# EAGLE design ThermoActuator (EAGLE 7.1.0)
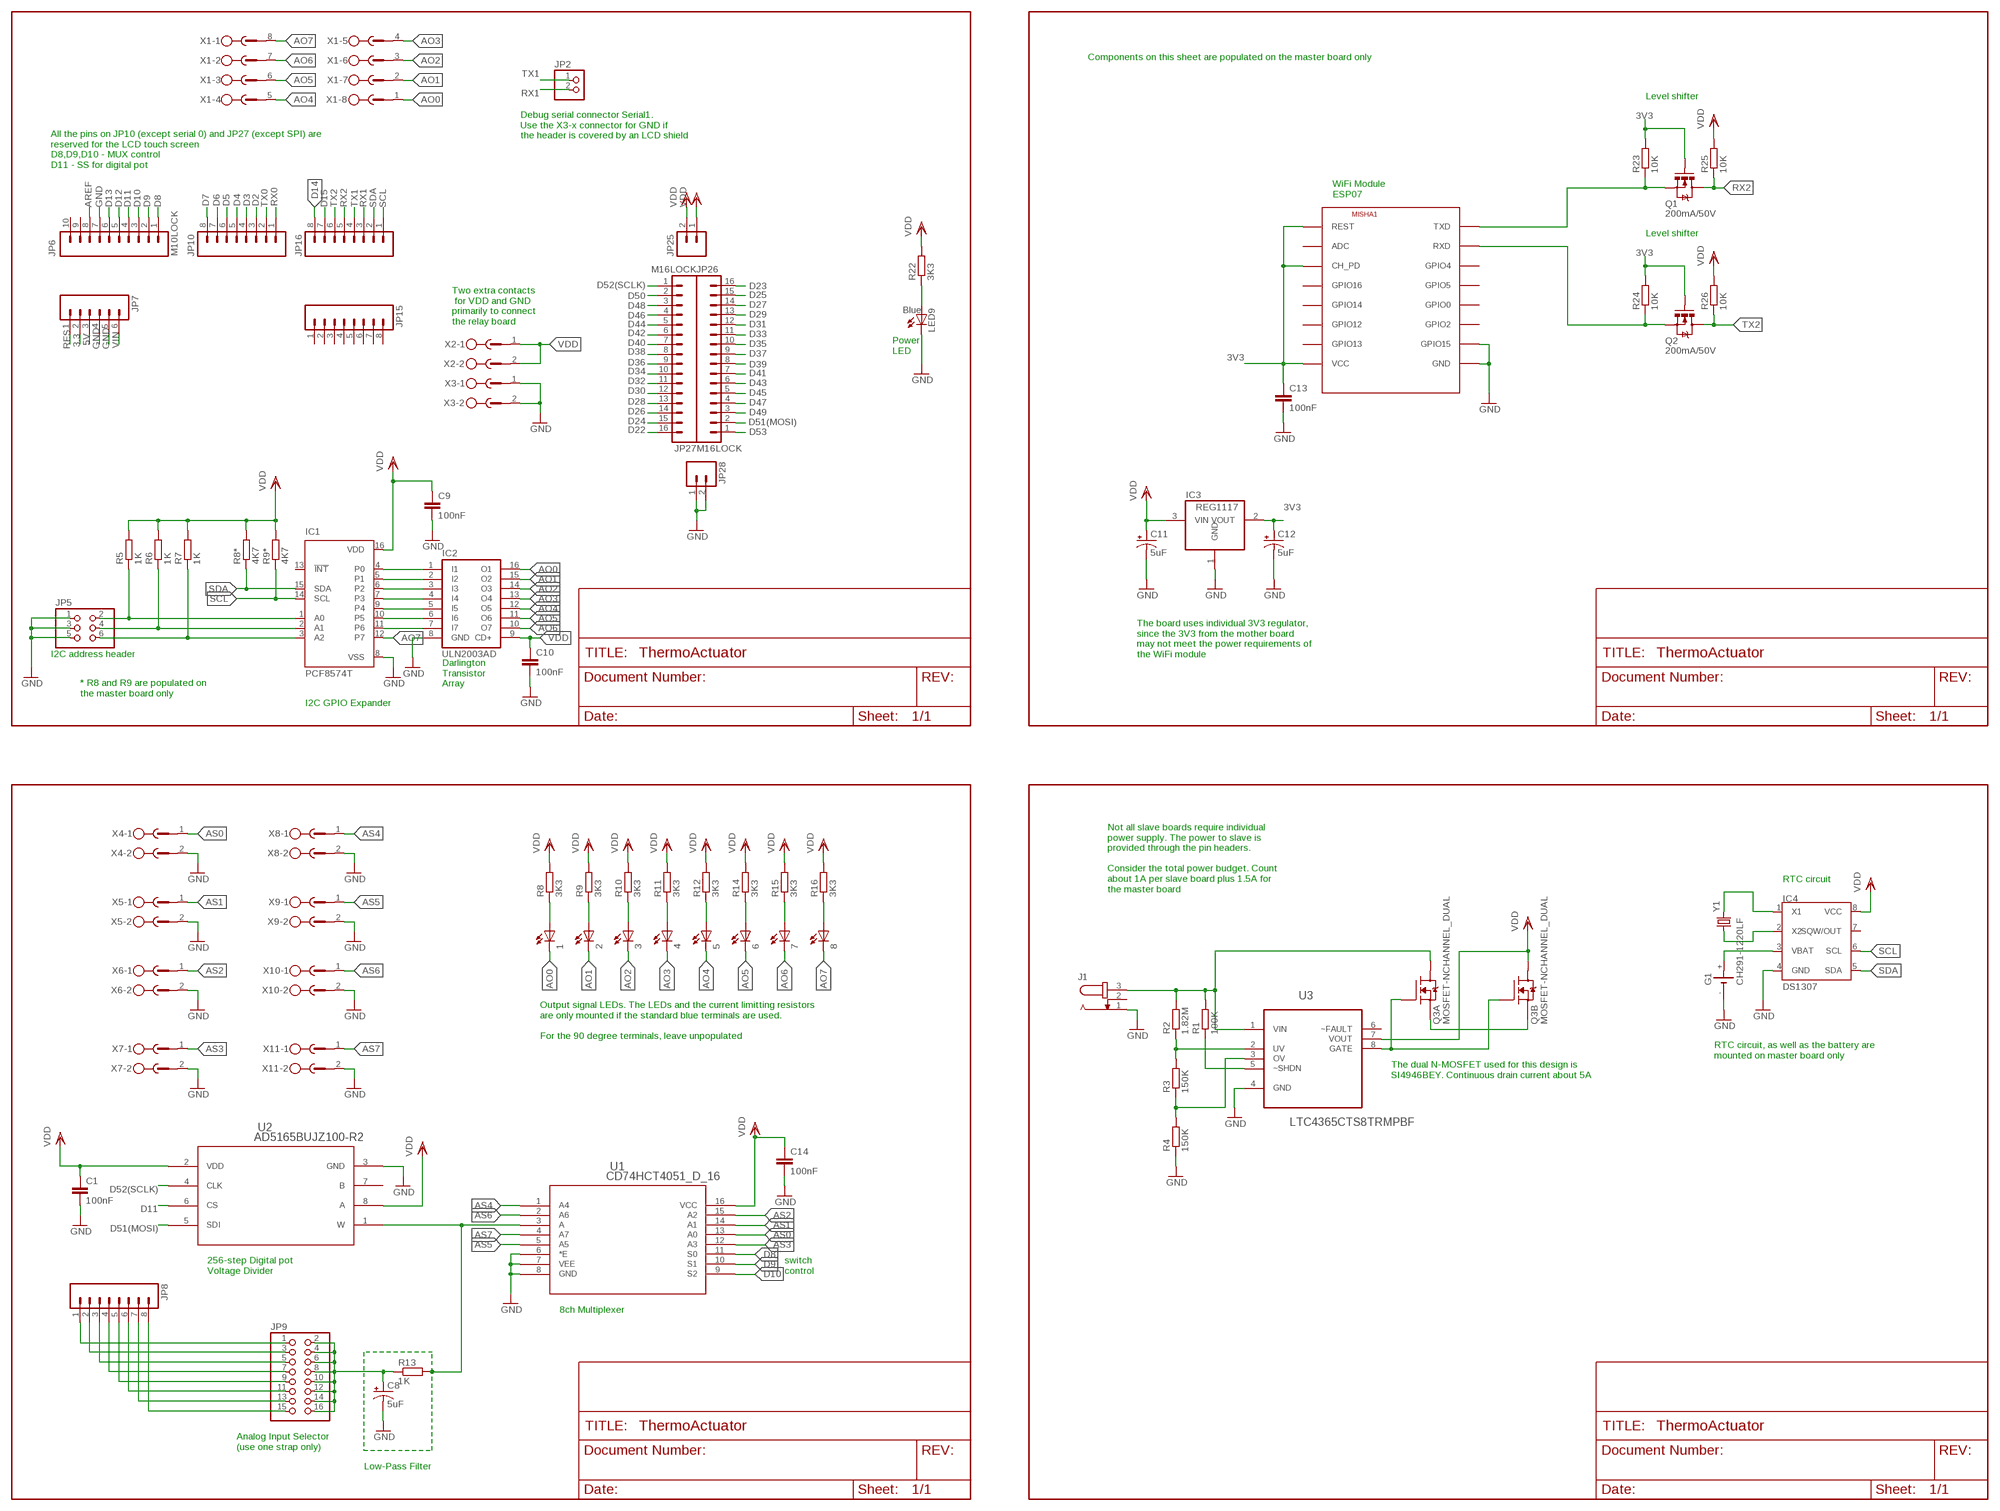
[diagram p0: schematic, sheet 1]

## Parts
1  LEDCHIP-LED0805  [CHIP-LED0805]
2  LEDCHIP-LED0805  [CHIP-LED0805]
3  LEDCHIP-LED0805  [CHIP-LED0805]
4  LEDCHIP-LED0805  [CHIP-LED0805]
5  LEDCHIP-LED0805  [CHIP-LED0805]
6  LEDCHIP-LED0805  [CHIP-LED0805]
7  LEDCHIP-LED0805  [CHIP-LED0805]
8  LEDCHIP-LED0805  [CHIP-LED0805]
C1  100nF  C-EUC0805  [C0805]
C8  5uF  CAP_POL1206  [EIA3216]
C9  100nF  C-EUC0805  [C0805]
C10  100nF  C-EUC0805  [C0805]
C11  5uF  CAP_POL1206  [EIA3216]
C12  5uF  CAP_POL1206  [EIA3216]
C13  100nF  C-EUC0805  [C0805]
C14  100nF  C-EUC0805  [C0805]
G1  CH291-1220LF  [CH291-1220LF]
IC1  PCF8574T  [SO16W]
IC2  ULN2003AD  [SO16]
IC3  REG1117  [SOT223]
IC4  DS1307  [SOIC-8]
J1  JACK-PLUG1  [SPC4078]
JP2  PINHD-1X2  [1X02]
JP5  PINHD-2X3  [2X03]
JP6  M10LOCK  [1X10_LOCK]
JP7  M06LOCK  [1X06_LOCK]
JP8  M08LOCK  [1X08_LOCK]
JP9  PINHD-2X8  [2X08]
JP10  M08LOCK  [1X08_LOCK]
JP15  M08LOCK  [1X08_LOCK]
JP16  M08LOCK  [1X08_LOCK]
JP25  M02LOCK  [1X02_LOCK]
JP26  M16LOCK  [1X16_LOCK]
JP27  M16LOCK  [1X16_LOCK]
JP28  M02LOCK  [1X02_LOCK]
LED9  Blue  LEDCHIP-LED0805  [CHIP-LED0805]
MISHA1  ESP8266-07  [ESP-07]
Q1  200mA/50V  MOSFET-NCHANNELBSS138  [SOT23-3]
Q2  200mA/50V  MOSFET-NCHANNELBSS138  [SOT23-3]
Q3  MOSFET-NCHANNEL_DUAL  [SO08]
R1  100K  R-EU_R0805  [R0805]
R2  1.82M  R-EU_R0805  [R0805]
R3  150K  R-EU_R0805  [R0805]
R4  150K  R-EU_R0805  [R0805]
R5  1K  R-EU_R0805  [R0805]
R6  1K  R-EU_R0805  [R0805]
R7  1K  R-EU_R0805  [R0805]
R8  3K3  R-EU_R0805  [R0805]
R8*  4K7  R-EU_R0805  [R0805]
R9  3K3  R-EU_R0805  [R0805]
R9*  4K7  R-EU_R0805  [R0805]
R10  3K3  R-EU_R0805  [R0805]
R11  3K3  R-EU_R0805  [R0805]
R12  3K3  R-EU_R0805  [R0805]
R13  1K  R-EU_R1206  [R1206]
R14  3K3  R-EU_R0805  [R0805]
R15  3K3  R-EU_R0805  [R0805]
R16  3K3  R-EU_R0805  [R0805]
R22  3K3  R-EU_R0805  [R0805]
R23  10K  R-EU_R0805  [R0805]
R24  10K  R-EU_R0805  [R0805]
R25  10K  R-EU_R0805  [R0805]
R26  10K  R-EU_R0805  [R0805]
U1  CD74HCT4051_D_16  [D16]
U2  AD5165BUJZ100-R2  [UJ_8]
U3  LTC4365CTS8TRMPBF  [SOT65P280X100-8N]
X1  MSTBV8  [MSTBV8]
X2  MSTBV2  [MSTBV2]
X3  MSTBV2  [MSTBV2]
X4  MSTBV2  [MSTBV2]
X5  MSTBV2  [MSTBV2]
X6  MSTBV2  [MSTBV2]
X7  MSTBV2  [MSTBV2]
X8  MSTBV2  [MSTBV2]
X9  MSTBV2  [MSTBV2]
X10  MSTBV2  [MSTBV2]
X11  MSTBV2  [MSTBV2]
Y1  CRYSTAL3.2X1.5MM  [CRYSTAL-SMD-3.2X1.5MM]

## Nets
3.3: JP7.2
3V3: C12.A(+) C13.1 IC3.2(VOUT) MISHA1.CH_PD MISHA1.REST MISHA1.VCC Q1.1(G) Q2.1(G) R23.2 R24.2
5V: JP7.3
AO0: 1.C IC2.16(O1) X1.1
AO1: 2.C IC2.15(O2) X1.2
AO2: 3.C IC2.14(O3) X1.3
AO3: 4.C IC2.13(O4) X1.4
AO4: 5.C IC2.12(O5) X1.5
AO5: 6.C IC2.11(O6) X1.6
AO6: 7.C IC2.10(O7) X1.7
AO7: 8.C IC1.12(P7) X1.8
AREF: JP6.8
AS0: U1.13(A0) X4.1
AS1: U1.14(A1) X5.1
AS2: U1.15(A2) X6.1
AS3: U1.12(A3) X7.1
AS4: U1.1(A4) X8.1
AS5: U1.5(A5) X9.1
AS6: U1.2(A6) X10.1
AS7: U1.4(A7) X11.1
D2: JP10.3
D3: JP10.4
D4: JP10.5
D5: JP10.6
D6: JP10.7
D7: JP10.8
D8: JP6.1 U1.11(S0)
D9: JP6.2 U1.10(S1)
D10: JP6.3 U1.9(S2)
D11: JP6.4 U2.6(CS)
D12: JP6.5
D13: JP6.6
D14: JP16.8
D15: JP16.7
D22: JP27.16
D23: JP26.16
D24: JP27.15
D25: JP26.15
D26: JP27.14
D27: JP26.14
D28: JP27.13
D29: JP26.13
D30: JP27.12
D31: JP26.12
D32: JP27.11
D33: JP26.11
D34: JP27.10
D35: JP26.10
D36: JP27.9
D37: JP26.9
D38: JP27.8
D39: JP26.8
D40: JP27.7
D41: JP26.7
D42: JP27.6
D43: JP26.6
D44: JP27.5
D45: JP26.5
D46: JP27.4
D47: JP26.4
D48: JP27.3
D49: JP26.3
D50: JP27.2
D51(MOSI): JP26.2 U2.5(SDI)
D52(SCLK): JP27.1 U2.4(CLK)
D53: JP26.1
GND: C1.2 C8.C(-) C9.2 C10.2 C11.C(-) C12.C(-) C13.2 C14.2 G1.- IC1.8(VSS) IC2.8(GND) IC3.1(GND) IC4.4(GND) J1.1 JP5.1 JP5.3 JP5.5 JP6.7 JP7.4 JP7.5 JP28.1 JP28.2 LED9.C MISHA1.GND MISHA1.GPIO15 R4.1 U1.6(*E) U1.7(VEE) U1.8(GND) U2.3(GND) U3.4(GND) X3.1 X3.2 X4.2 X5.2 X6.2 X7.2 X8.2 X9.2 X10.2 X11.2
N$1: R1.1 U3.5(~SHDN)
N$2: R13.2 U1.3(A) U2.1(W)
N$3: IC1.4(P0) IC2.1(I1)
N$4: IC1.5(P1) IC2.2(I2)
N$5: IC1.6(P2) IC2.3(I3)
N$6: IC1.7(P3) IC2.4(I4)
N$7: IC1.9(P4) IC2.5(I5)
N$8: IC1.10(P5) IC2.6(I6)
N$9: IC1.11(P6) IC2.7(I7)
N$10: IC1.1(A0) JP5.2 R5.1
N$11: 1.A R8.1
N$12: R2.1 R3.2 U3.2(UV)
N$13: R3.1 R4.2 U3.3(OV)
N$14: Q3.2(B:G) Q3.4(A:G) U3.8(GATE)
N$15: Q3.1(B:S) Q3.3(A:S)
N$20: IC4.1(X1) Y1.P$2
N$21: IC4.2(X2) Y1.P$1
N$22: G1.+ IC4.3(VBAT)
N$23: 2.A R9.1
N$24: IC1.2(A1) JP5.4 R6.1
N$25: IC1.3(A2) JP5.6 R7.1
N$26: JP8.1 JP9.1
N$27: JP8.2 JP9.3
N$28: JP8.3 JP9.5
N$29: JP8.4 JP9.7
N$30: JP8.5 JP9.9
N$31: JP8.6 JP9.11
N$32: 3.A R10.1
N$36: C8.A(+) JP9.2 JP9.4 JP9.6 JP9.8 JP9.10 JP9.12 JP9.14 JP9.16 R13.1
N$37: JP8.7 JP9.13
N$38: JP8.8 JP9.15
N$40: MISHA1.TXD Q1.2(S) R23.1
N$41: MISHA1.RXD Q2.2(S) R24.1
N$42: J1.3 Q3.6(A:D1) R1.2 R2.2 U3.1(VIN)
N$46: 4.A R11.1
N$47: 5.A R12.1
N$48: 6.A R14.1
N$49: 7.A R15.1
N$50: 8.A R16.1
N$126: LED9.A R22.1
RES: JP7.1
RX0: JP10.1
RX1: JP2.2 JP16.3
RX2: JP16.5 Q1.3(D) R25.1
SCL: IC1.14(SCL) IC4.6(SCL) JP16.1 R9*.1
SDA: IC1.15(SDA) IC4.5(SDA) JP16.2 R8*.1
TX0: JP10.2
TX1: JP2.1 JP16.4
TX2: JP16.6 Q2.3(D) R26.1
VDD: C1.1 C9.1 C10.1 C11.A(+) C14.1 IC1.16(VDD) IC2.9(CD+) IC3.3(VIN) IC4.8(VCC) JP25.1 JP25.2 Q3.8(B:D1) R5.2 R6.2 R7.2 R8*.2 R8.2 R9*.2 R9.2 R10.2 R11.2 R12.2 R14.2 R15.2 R16.2 R22.2 R25.2 R26.2 U1.16(VCC) U2.2(VDD) U2.8(A) U3.7(VOUT) X2.1 X2.2
VIN: JP7.6
Unconnected: IC1.13(!INT) IC4.7(SQW/OUT) J1.2 JP6.9 JP6.10 JP15.1 JP15.2 JP15.3 JP15.4 JP15.5 JP15.6 JP15.7 JP15.8 MISHA1.ADC MISHA1.GPIO0 MISHA1.GPIO2 MISHA1.GPIO4 MISHA1.GPIO5 MISHA1.GPIO12 MISHA1.GPIO13 MISHA1.GPIO14 MISHA1.GPIO16 Q3.5(A:D) Q3.7(B:D) U2.7(B) U3.6(~FAULT)

## Notes on the sheet
- Components on this sheet are populated on the master board only
- Level shifter
- Debug serial connector Serial1.
  Use the X3-x connector for GND if
  the header is covered by an LCD shield
- All the pins on JP10 (except serial 0) and JP27 (except SPI) are 
  reserved for the LCD touch screen
  D8,D9,D10 - MUX control
  D11 - SS for digital pot
- WiFi Module
  ESP07
- Level shifter
- Two extra contacts
   for VDD and GND 
  primarily to connect 
  the relay board
- Power 
  LED
- I2C address header
- The board uses individual 3V3 regulator,
  since the 3V3 from the mother board
  may not meet the power requirements of 
  the WiFi module
- Darlington 
  Transistor 
  Array
- * R8 and R9 are populated on 
  the master board only
- I2C GPIO Expander
- RTC circuit
- Not all slave boards require individual
  power supply. The power to slave is
  provided through the pin headers.
  
  Consider the total power budget. Count 
  about 1A per slave board plus 1.5A for 
  the master board
- Output signal LEDs. The LEDs and the current limitting resistors 
  are only mounted if the standard blue terminals are used.
  
  For the 90 degree terminals, leave unpopulated
- RTC circuit, as well as the battery are 
  mounted on master board only
- The dual N-MOSFET used for this design is 
  SI4946BEY. Continuous drain current about 5A
- 256-step Digital pot
  Voltage Divider
- switch
  control
- 8ch Multiplexer
- Analog Input Selector
  (use one strap only)
- Low-Pass Filter

## Library data of the parts
1-8 LED9 = led:LED: LED OSRAM: - CHIPLED LG R971, LG N971, LY N971, LG Q971, LY Q971, LO R971, LY R971 LH N974, LH R974 LS Q976, LO Q976, LY Q976 LO Q996 - Hyper CHIPLED LW Q18S LB Q993, LB Q99A, LB R99A - SideLED LS A670, LO A670, LY A670, LG A670, LP A670 LB A673, LV A673, LT A673, LW A673 LH A674 LY A675 LS A676, LA A676, LO A676, LY A676, LW A676 LS A679, LY A679, LG A679 - Hyper Micro SIDELED® LS Y876, LA Y876, LO Y876, LY Y876 LT Y87S - SmartLED LW L88C, LW L88S LB L89C, LB L89S, LG L890 LS L89K, LO L89K, LY L89K LS L896, LA L896, LO L896, LY L896 - TOPLED LS T670, LO T670, LY T670, LG T670, LP T670 LSG T670, LSP T670, LSY T670, LOP T670, LYG T670 LG T671, LOG T671, LSG T671 LB T673, LV T673, LT T673, LW T673 LH T674 LS T676, LA T676, LO T676, LY T676, LB T676, LH T676, LSB T676, LW T676 LB T67C, LV T67C, LT T67C, LS T67K, LO T67K, LY T67K, LW E67C LS E67B, LA E67B, LO E67B, LY E67B, LB E67C, LV E67C, LT E67C LW T67C LS T679, LY T679, LG T679 LS T770, LO T770, LY T770, LG T770, LP T770 LB T773, LV T773, LT T773, LW T773 LH T774 LS E675, LA E675, LY E675, LS T675 LS T776, LA T776, LO T776, LY T776, LB T776 LHGB T686 LT T68C, LB T68C - Hyper Mini TOPLED® LB M676 - Mini TOPLED Santana® LG M470 LS M47K, LO M47K, LY M47K Source: http://www.osram.convergy.de LUXEON: - LUMILED® LXK2-PW12-R00, LXK2-PW12-S00, LXK2-PW14-U00, LXK2-PW14-V00 LXK2-PM12-R00, LXK2-PM12-S00, LXK2-PM14-U00 LXK2-PE12-Q00, LXK2-PE12-R00, LXK2-PE12-S00, LXK2-PE14-T00, LXK2-PE14-U00 LXK2-PB12-K00, LXK2-PB12-L00, LXK2-PB12-M00, LXK2-PB14-N00, LXK2-PB14-P00, LXK2-PB14-Q00 LXK2-PR12-L00, LXK2-PR12-M00, LXK2-PR14-Q00, LXK2-PR14-R00 LXK2-PD12-Q00, LXK2-PD12-R00, LXK2-PD12-S00 LXK2-PH12-R00, LXK2-PH12-S00 LXK2-PL12-P00, LXK2-PL12-Q00, LXK2-PL12-R00 Source: www.luxeon.com KINGBRIGHT: KA-3528ASYC Source: www.kingbright.com
C1 C9 C10 C13 C14 = rcl:C-EU: CAPACITOR, European symbol
C8 C11 C12 = SparkFun-Capacitors:CAP_POL: Capacitor Polarized These are standard SMD and PTH capacitors. Normally 10uF, 47uF, and 100uF in electrolytic and tantalum varieties. Always verify the external diameter of the through hole cap, it varies with capacity, voltage, and manufacturer. The EIA devices should be standard.
G1 = battery:CH291-1220LF: Battery Holder, SMT, 12mm multicomp PART NO. CH291-1220LF Source: Data sheet <http://www.farnell.com/datasheets/1505860.pdf>
IC1 = micro-philips:PCF8574: I2C-Bus Remote 8-bit I/O expander http://www.semiconductors.philips.com/acrobat_download/datasheets/PCF8574_4.pdf; MPN: PCF8574T/3,512; OC_FARNELL: 1201255; OC_NEWARK: 70R6870
IC2 = uln-udn:ULN2003A: DRIVER ARRAY
IC3 = burr-brown:REG1117: 800mA and 1A Low Dropout (LDO) Positive Regulator 1.8V, 2.5V, 2.85V, 3.3V, 5V, and Adj; MPN: REG1117; OC_FARNELL: 1097566; OC_NEWARK: 14P6981
IC4 = dallas-1:DS1307: I2C Serial RTC w/56 bytes battery backed RAM
J1 = con-jack:JACK-PLUG: DC POWER JACK Power Jack, DC, Right Angle, Through Hole, Rated 5A at 16VDC, PC Terminals Distributor: Farnell (www.Farnell.de) Drawing: 84N1161.pdf / 84N1162.pdf Manufacturer: SPC Technology (www.spctechnology.com) Type: SPC4077 / SPC 4078; OC_FARNELL: unknown; OC_NEWARK: unknown
JP2 = pinhead:PINHD-1X2: PIN HEADER
JP5 = pinhead:PINHD-2X3: PIN HEADER
JP6 = SparkFun-Connectors:M10: Header 10 Standard 10-pin 0.1" header. Use with straight break away headers (SKU : PRT-00116), right angle break away headers (PRT-00553), swiss pins (PRT-00743), machine pins (PRT-00117), and female headers (PRT-00115).
JP7 = SparkFun:M06: Header 6 Standard 6-pin 0.1" header. Use with straight break away headers (SKU : PRT-00116), right angle break away headers (PRT-00553), swiss pins (PRT-00743), machine pins (PRT-00117), and female headers (PRT-00115). Molex polarized connector foot print use with SKU : PRT-08094 with associated crimp pins and housings. NOTES ON THE VARIANTS LOCK and LOCK_LONGPADS... This footprint was designed to help hold the alignment of a through-hole component (i.e. 6-pin header) while soldering it into place. You may notice that each hole has been shifted either up or down by 0.005 of an inch from it's more standard position (which is a perfectly straight line). This slight alteration caused the pins (the squares in the middle) to touch the edges of the holes. Because they are alternating, it causes a "brace" to hold the component in place. 0.005 has proven to be the perfect amount of "off-center" position when using our standard breakaway headers. Although looks a little odd when you look at the bare footprint, once you have a header in there, the alteration is very hard to notice. Also, if you push a header all the way into place, it is covered up entirely on the bottom side. This idea of altering the position of holes to aid alignment will be further integrated into the Sparkfun Library for other footprints. It can help hold any component with 3 or more connection pins.
JP8 JP10 JP15 JP16 = SparkFun:M08: Header 8 Standard 8-pin 0.1" header. Use with straight break away headers (SKU : PRT-00116), right angle break away headers (PRT-00553), swiss pins (PRT-00743), machine pins (PRT-00117), and female headers (PRT-00115).
JP9 = pinhead:PINHD-2X8: PIN HEADER
JP25 JP28 = SparkFun:M02: Header 2 Standard 2-pin 0.1" header. Use with straight break away headers (SKU : PRT-00116), right angle break away headers (PRT-00553), swiss pins (PRT-00743), machine pins (PRT-00117), and female headers (PRT-00115). Molex polarized connector foot print use with SKU : PRT-08233 with associated crimp pins and housings.
JP26 JP27 = SparkFun:M16
MISHA1 = lio:ESP8266
Q1 Q2 = SparkFun-DiscreteSemi:MOSFET-NCHANNEL: Common NMOSFET Parts MFG P/N Store ID Prod ID FDD8780 TRANS-09984 SI7820DN TRANS-11055 FDS6630A IC-08089 2N7002PW TRANS-11151 FQP30N06L COM-10213 TRANS-10060 BSS123LT1G TRANS-08345 BSS138 TRANS-00830 BS170 2N7000; PROD_ID: TRANS-00830
Q3 = lio:MOSFET-NCHANNEL_DUAL: Dual N-Channel 30-V (D-S) MOSFET FDMA1024NZ TRANS-09516 http://www.vishay.com/docs/71053/71053.pdf
R1-R8 R8* R9 R9* R10-R16 R22-R26 = rcl:R-EU_: RESISTOR, European symbol
U1 = misha-74HCT4051:CD74HCT4051_D_16; DATASHEETURL: http://www.ti.com/lit/gpn/CD74HCT4051; DESCRIPTION: High Speed CMOS 8-Channel Analog Multiplexer/Demultiplexer with TTL inputs; FAMILY_NAME: ANALOG SWITCH/MULTIPLEXER(less than or equal to 5V); GENERIC_PART_NUMBER: CD74HCT4051; INDUSTRY_STD_PKG_TYPE: SOIC; MANUFACTURER: Texas Instruments; PACKAGE_DESIGNATOR: D; PIN_COUNT: 16
U2 = AD5165_DigitalPot:AD5165BUJZ100-R2
U3 = LTC_By_element14_Batch_1:LTC4365CTS8TRMPBF: UV, OV and Reverse Supply Protection Controller; MPN: LTC4365CTS8#TRMPBF; OC_FARNELL: 1847455; OC_NEWARK: 24T2682; PACKAGE: TSOT-23-8; SUPPLIER: Linear Technology
X1 = con-phoenix-500:MSTBV8: PHOENIX; OC_FARNELL: unknown; OC_NEWARK: unknown
X2-X11 = con-phoenix-500:MSTBV2: PHOENIX; OC_FARNELL: unknown; OC_NEWARK: unknown
Y1 = SparkFun-FreqCtrl:CRYSTAL: Various standard crystals. Proven footprints.

## Board
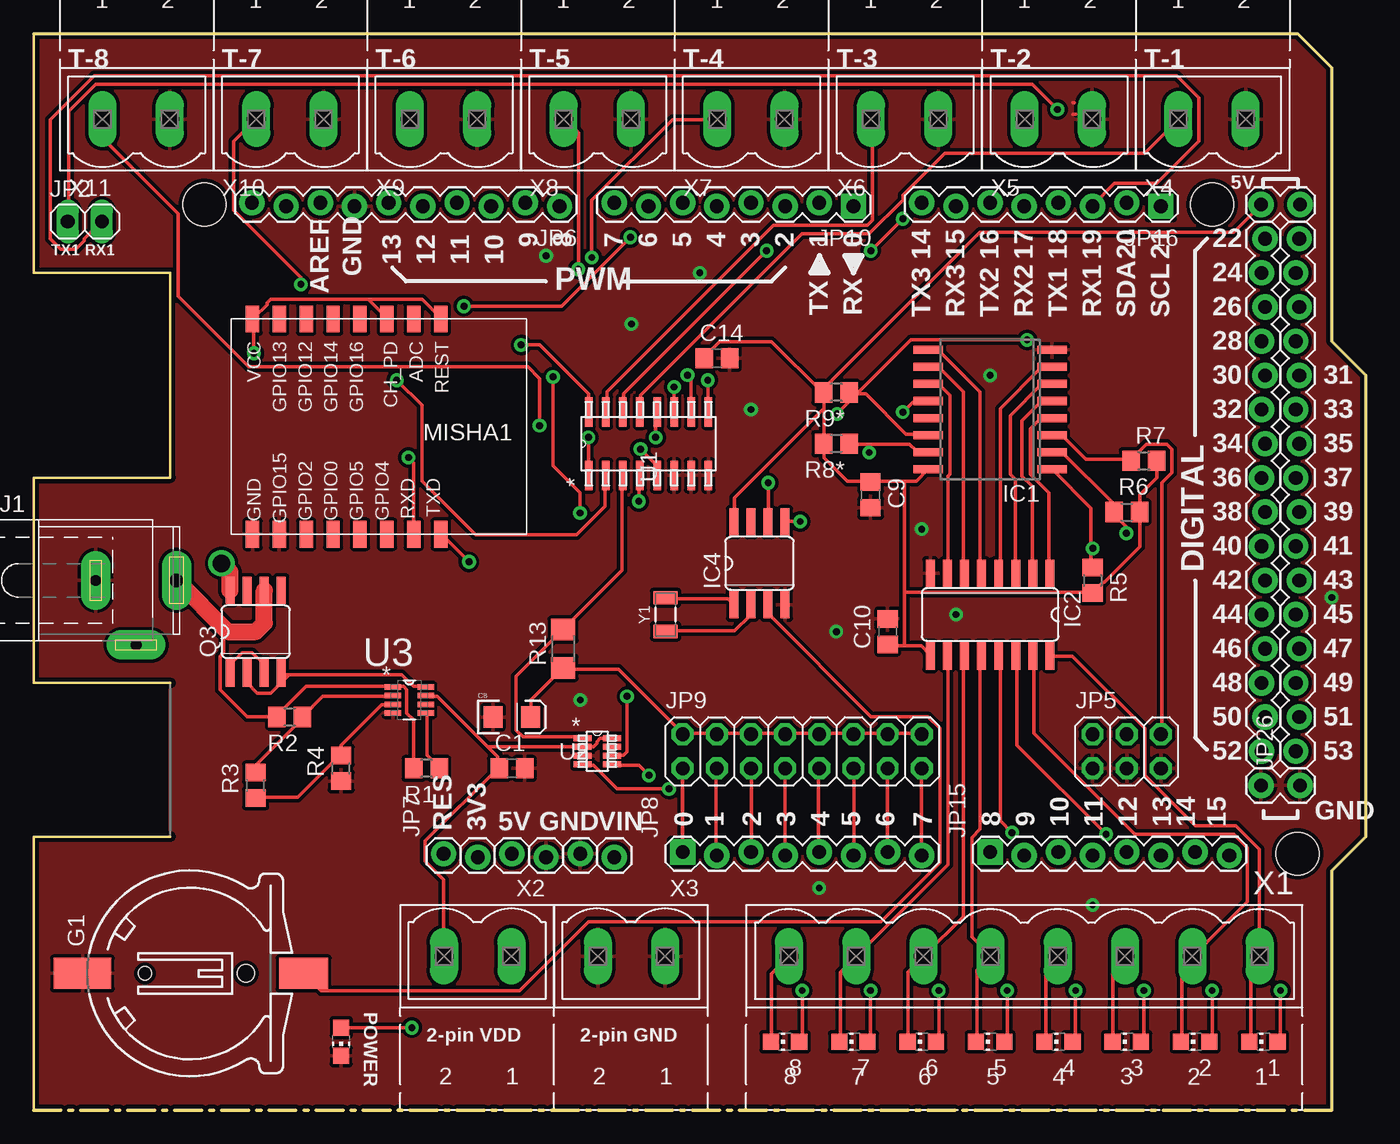
[diagram p1: board, top side]
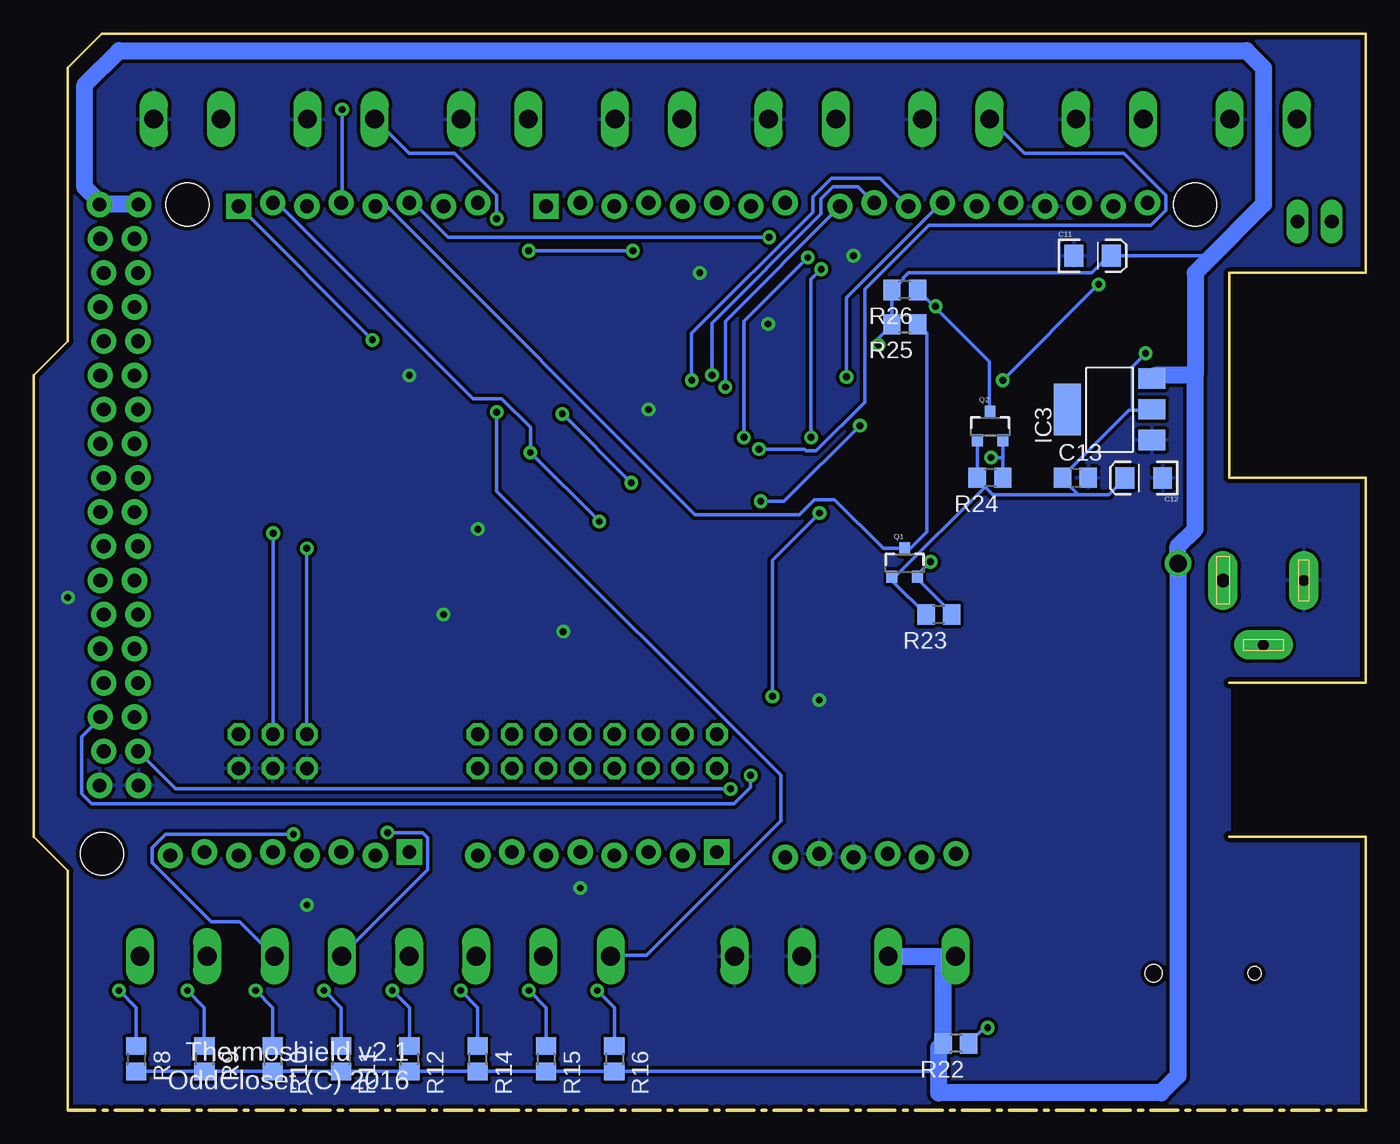
[diagram p2: board, bottom side, seen from below]

Size 99.06 x 80.01 mm. Coordinates in mm from the lower left corner, seen from the top.
Outline: 10,62.23 0,62.23 0,80.01 93.98,80.01 96.52,77.47 96.52,57.15 99.06,54.61 99.06,20.32 96.52,17.78 96.52,0 0,0 0,20.32 10.16,20.32
Outline: 0,47 10.16,47 10.16,62.23
Outline: 0,46.99 0,31.75 10.16,31.75
Copper layers (1*16): Top 0.035mm / dielectric 1.5mm / Bottom 0.035mm
Design rules "SparkFun *": minimum track width 10mil, minimum drill 20mil, track to track 10mil, track to pad 10mil, pad to pad 10mil, via to via 10mil, smd to smd 10mil, copper to edge 12mil, drill to drill 10mil, minimum pad ring 12mil, minimum via ring 10mil, stop-mask expansion 4mil, vias tented up to drill 25mil, thermal gap 10mil
Holes 3.2 mm at 12.7,67.31 87.63,67.31 93.98,19.05
tRestrict: area 33,43.2 to 36.8,54.6
bRestrict: area 33,43.2 to 36.8,54.6

### Footprints (pad centres in the part's own frame; a part is rotated, then mirrored left to right if it is on the bottom)
CHIP-LED0805 = smd 1.2 x 1.2: A 0,-1.05; C 0,1.05
C0805 = smd 1.3 x 1.5: 1 -0.95,0; 2 0.95,0
EIA3216 = smd 1.4 x 1.6: A 1.4,0; C -1.4,0
CH291-1220LF = smd 2.3 x 3.66: + 0,-2.296 | smd 2.3 x 4.3: - 0,14.146 | hole 1.3: 0,2 | hole 1: 0,9.5
SO16W = smd 0.6 x 2.2: 1 -4.445,-4.6; 2 -3.175,-4.6; 3 -1.905,-4.6; 4 -0.635,-4.6; 5 0.635,-4.6; 6 1.905,-4.6; 7 3.175,-4.6; 8 4.445,-4.6; 9 4.445,4.6; 10 3.175,4.6; 11 1.905,4.6; 12 0.635,4.6; 13 -0.635,4.6; 14 -1.905,4.6; 15 -3.175,4.6; 16 -4.445,4.6
SO16 = smd 0.66 x 2.032: 1 -4.445,-3.073; 2 -3.175,-3.073; 3 -1.905,-3.073; 4 -0.635,-3.073; 5 0.635,-3.073; 6 1.905,-3.073; 7 3.175,-3.073; 8 4.445,-3.073; 9 4.445,3.073; 10 3.175,3.073; 11 1.905,3.073; 12 0.635,3.073; 13 -0.635,3.073; 14 -1.905,3.073; 15 -3.175,3.073; 16 -4.445,3.073
SOT223 = smd 1.499 x 2.007: 1 -2.261,-3.15; 2 0.025,-3.15; 3 2.311,-3.15 | smd 3.81 x 2.007: 4 0,3.15
SOIC-8 = smd 2.032 x 0.66: 1 -3.073,1.27; 2 -3.073,0; 3 -3.073,-1.27; 4 -3.073,-2.54; 5 3.073,-2.54; 6 3.073,-1.27; 7 3.073,0; 8 3.073,1.27
SPC4078 = drill 0.8 pad 2.184 long: 1 -3,0; 2 0,-4.8 | drill 1 pad 2.184 long: 3 3,0
1X02 = drill 1.016 long: 1 -1.27,0; 2 1.27,0
2X03 = drill 1.016 octagon: 1 -2.54,-1.27; 2 -2.54,1.27; 3 0,-1.27; 4 0,1.27; 5 2.54,-1.27; 6 2.54,1.27
1X10_LOCK = drill 1.016 pad 1.88: 1 0,0.127; 2 2.54,-0.127; 3 5.08,0.127; 4 7.62,-0.127; 5 10.16,0.127; 6 12.7,-0.127; 7 15.24,0.127; 8 17.78,-0.127; 9 20.32,0.127; 10 22.86,-0.127
1X06_LOCK = drill 1.016 pad 1.88: 1 0,0; 2 2.54,-0.254; 3 5.08,0; 4 7.62,-0.254; 5 10.16,0; 6 12.7,-0.254
1X08_LOCK = drill 1.016 pad 1.88 square: 1 0,0.127 | drill 1.016 pad 1.88: 2 2.54,-0.127; 3 5.08,0.127; 4 7.62,-0.127; 5 10.16,0.127; 6 12.7,-0.127; 7 15.24,0.127; 8 17.78,-0.127
2X08 = drill 1.016 octagon: 1 -8.89,-1.27; 2 -8.89,1.27; 3 -6.35,-1.27; 4 -6.35,1.27; 5 -3.81,-1.27; 6 -3.81,1.27; 7 -1.27,-1.27; 8 -1.27,1.27; 9 1.27,-1.27; 10 1.27,1.27; 11 3.81,-1.27; 12 3.81,1.27; 13 6.35,-1.27; 14 6.35,1.27; 15 8.89,-1.27; 16 8.89,1.27
1X02_LOCK = drill 1.016 pad 1.88: 1 -0.178,0; 2 2.718,0
1X16_LOCK = drill 1.016 pad 1.88: 1 0,0.127; 2 2.54,-0.127; 3 5.08,0.127; 4 7.62,-0.127; 5 10.16,0.127; 6 12.7,-0.127; 7 15.24,0.127; 8 17.78,-0.127; 9 20.32,0.127; 10 22.86,-0.127; 11 25.4,0.127; 12 27.94,-0.127; 13 30.48,0.127; 14 33.02,-0.127; 15 35.56,0.127; 16 38.1,-0.127
ESP-07 = smd 1 x 2: ADC -1.6,-8; CH_PD 0.4,-8; GND 10.4,8; GPIO0 4.4,8; GPIO2 6.4,8; GPIO4 0.4,8; GPIO5 2.4,8; GPIO12 6.4,-8; GPIO13 8.4,-8; GPIO14 4.4,-8; GPIO15 8.4,8; GPIO16 2.4,-8; REST -3.6,-8; RXD -1.6,8; TXD -3.6,8; VCC 10.4,-8
SOT23-3 = smd 0.8 x 0.9: 1 -0.95,-1; 2 0.95,-1; 3 0,1.1
SO08 = smd 0.66 x 2.032: 1 -1.905,-3.073; 2 -0.635,-3.073; 3 0.635,-3.073; 4 1.905,-3.073; 5 1.905,3.073; 6 0.635,3.073; 7 -0.635,3.073; 8 -1.905,3.073
R0805 = smd 1.3 x 1.5: 1 -0.95,0; 2 0.95,0
R1206 = smd 1.6 x 1.803: 1 -1.422,0; 2 1.422,0
D16 = smd 2.184 x 0.559: 1 -2.362,4.445; 2 -2.362,3.175; 3 -2.362,1.905; 4 -2.362,0.635; 5 -2.362,-0.635; 6 -2.362,-1.905; 7 -2.362,-3.175; 8 -2.362,-4.445; 9 2.362,-4.445; 10 2.362,-3.175; 11 2.362,-1.905; 12 2.362,-0.635; 13 2.362,0.635; 14 2.362,1.905; 15 2.362,3.175; 16 2.362,4.445
UJ_8 = smd 1.321 x 0.432: 1 -1.092,0.975; 2 -1.092,0.325; 3 -1.092,-0.325; 4 -1.092,-0.975; 5 1.092,-0.975; 6 1.092,-0.325; 7 1.092,0.325; 8 1.092,0.975
SOT65P280X100-8N = smd 1.219 x 0.406: 1 -1.219,0.965; 2 -1.219,0.33; 3 -1.219,-0.33; 4 -1.219,-0.965; 5 1.219,-0.965; 6 1.219,-0.33; 7 1.219,0.33; 8 1.219,0.965
MSTBV8 = drill 1.397 long: 1 -17.501,0; 2 -12.497,0; 3 -7.493,0; 4 -2.489,0; 5 2.515,0; 6 7.493,0; 7 12.497,0; 8 17.501,0
MSTBV2 = drill 1.397 long: 1 -2.5,0; 2 2.5,0
CRYSTAL-SMD-3.2X1.5MM = smd 1 x 1.8: P$1 -1.25,0; P$2 1.25,0

### Placement (x,y rotation side)
1  91.44,5.08 90 top
2  86.36,5.08 90 top
3  81.28,5.08 90 top
4  76.2,5.08 90 top
5  71.12,5.08 90 top
6  66.04,5.08 90 top
7  60.96,5.08 90 top
8  55.88,5.08 90 top
C1  35.56,25.4 0 top
C8  35.56,29.21 0 top
C9  62.23,45.72 270 top
C10  63.5,35.56 90 top
C11  20.32,63.5 0 bottom
C12  16.51,46.99 180 bottom
C13  21.59,46.99 0 bottom
C14  50.8,55.88 0 top
G1  17.78,10.16 90 top
IC1  71.12,52.07 90 top
IC2  71.12,36.83 180 top
IC3  19.05,52.07 90 bottom
IC4  53.34,40.64 90 top
J1  7.62,39.37 0 top
JP2  3.81,66.04 0 top
JP5  81.28,26.67 0 top
JP6  39.1,67.31 180 top
JP7  30.48,19.05 0 top
JP8  48.26,19.05 0 top
JP9  57.15,26.67 0 top
JP10  60.96,67.31 180 top
JP15  71.12,19.05 0 top
JP16  83.82,67.31 180 top
JP25  91.44,67.31 0 top
JP26  93.98,26.67 90 top
JP27  91.44,26.67 90 top
JP28  91.44,24.13 0 top
LED9  22.86,5.08 180 top
MISHA1  26.67,50.8 180 top
Q1  34.29,40.64 0 bottom
Q2  27.94,50.8 0 bottom
Q3  16.51,35.56 0 top
R1  29.21,25.4 180 top
R2  19.05,29.21 180 top
R3  16.51,24.13 90 top
R4  22.86,25.4 90 top
R5  78.74,39.37 270 top
R6  81.28,44.45 0 top
R7  82.55,48.26 0 top
R8  91.44,3.81 270 bottom
R8*  59.69,49.53 180 top
R9  86.36,3.81 270 bottom
R9*  59.69,53.34 180 top
R10  81.28,3.81 270 bottom
R11  76.2,3.81 270 bottom
R12  71.12,3.81 270 bottom
R13  39.37,34.29 90 top
R14  66.04,3.81 270 bottom
R15  60.96,3.81 270 bottom
R16  55.88,3.81 270 bottom
R22  30.48,4.95 180 bottom
R23  31.75,36.83 180 bottom
R24  27.94,46.99 180 bottom
R25  34.29,58.42 180 bottom
R26  34.29,60.96 180 bottom
U1  45.72,49.53 90 top
U2  41.91,26.67 0 top
U3  27.94,30.48 0 top
X1  73.66,11.43 180 top
X2  33.02,11.43 180 top
X3  44.45,11.43 180 top
X4  87.63,73.66 0 top
X5  76.2,73.66 0 top
X6  64.77,73.66 0 top
X7  53.34,73.66 0 top
X8  41.91,73.66 0 top
X9  30.48,73.66 0 top
X10  19.05,73.66 0 top
X11  7.62,73.66 0 top
Y1  46.99,36.83 90 top

### Tracks (layer width: path | path; a pad name or v marks a point on that pad's centre or on a via)
3V3  (via drill 0.51)
  Top 0.254: 24.88,60.25 17.62,60.25 17.38,60 17.38,59.88 16.38,58.88 MISHA1.VCC 16.38,58.75 v16.38,56.25 | 24.88,60.25 26.25,58.88 MISHA1.CH_PD | 24.88,60.25 28.88,60.25 30.25,58.88 MISHA1.REST
  Bottom 0.254: R23.2 32.75,36.88 35.12,39.25 35.12,39.62 Q1.1 35,39.62 28.38,46.25 R24.2 | Q2.1 28.88,49.75 28.88,47 R24.2 | 21.44,45.81 21.38,45.75 19.12,45.75 18,46.88 C12.A | 21.44,45.81 22.5,46.88 C13.1 22.62,47 17.62,52 17.38,52 | 17.38,52 16,52 IC3.2 | R24.2 28.88,46.88 27.75,45.75 21.5,45.75 21.44,45.81 | v16.38,56.25 17.38,55.25 17.38,52
AO0
  Top 0.254: 1.C 90.5,5.12 90.5,10.75 91.12,11.38 X1.1 91.12,11.5 91.12,19.38 89.38,21.12 86.38,21.12 82.62,24.88 82.62,28.38 77.25,33.75 75.62,33.75 IC2.16
AO1
  Top 0.254: 2.C 85.38,5.12 85.38,10.62 86.12,11.38 X1.2 86.25,11.5 90.25,15.5 90.25,19.5 89.25,20.5 81.88,20.5 74.38,28 74.38,33.75 IC2.15
AO2  (via drill 0.51)
  Top 0.254: 3.C 80.25,5.12 80.25,10.5 81.12,11.38 X1.3 | v79.75,20.5 73.12,27.12 73.12,33.75 IC2.14
  Bottom 0.254: v79.75,20.5 89.25,20.5 90.25,19.5 90.25,18.38 85.88,14 83.75,14 81.25,11.5 X1.3
AO3  (via drill 0.51)
  Top 0.254: 4.C 75.25,5.12 75.25,10.5 76.12,11.38 X1.4 | v72.75,20.62 71.88,21.5 71.88,33.75 IC2.13
  Bottom 0.254: v72.75,20.62 70.12,20.62 69.75,20.25 69.75,17.88 76.12,11.5 X1.4
AO4
  Top 0.254: 5.C 70.12,5.12 70.12,10.38 71.12,11.38 X1.5 71.12,11.5 69.75,12.88 69.75,20.25 70.38,20.88 70.38,33.75 IC2.12
AO5
  Top 0.254: 6.C 65,5.12 65,10.25 66.12,11.38 X1.6 66.25,11.5 69.12,14.38 69.12,33.75 IC2.11
AO6
  Top 0.254: 7.C 60,5.12 60,10.25 61.12,11.38 X1.7 61.25,11.5 68,18.25 68,33.75 IC2.10
AO7  (via drill 0.51)
  Top 0.254: 8.C 54.88,5.12 54.88,10.12 56.12,11.38 X1.8 | v64.62,51.88 65.38,52.62 66.5,52.62 IC1.12
  Bottom 0.254: v64.62,51.88 64.62,46 43.5,24.88 43.5,21.5 53.5,11.5 56.12,11.5 X1.8
AS0
  Top 0.254: U1.13 45.12,52 45.12,53.12 57.12,65.12 62.12,65.12 64.62,67.62 64.62,68 67.75,71.12 82.62,71.12 85.12,73.62 X4.1
AS1  (via drill 0.51)
  Top 0.254: v54.5,63.88 43.88,53.25 43.88,52 U1.14 | v64.62,66.25 v62.25,63.88
  Bottom 0.254: v62.25,63.88 v54.5,63.88 | v64.62,66.25 64.62,68 67.75,71.12 71.12,71.12 73.62,73.62 X5.1
AS2
  Top 0.254: U1.15 42.62,52 42.62,53.38 55,65.75 62,65.75 62.38,66.12 62.38,73.62 X6.1
AS3  (via drill 0.51)
  Top 0.254: v46.25,50 46.25,51.88 U1.12 | v41.5,63.38 41.5,67.62 47.5,73.62 50.75,73.62 X7.1
  Bottom 0.254: v46.25,50 46.25,58.62 v41.5,63.38
AS4  (via drill 0.51)
  Top 0.254: v41.25,50 41.25,47.25 U1.1 | v40.5,62.5 40.5,72.62 39.5,73.62 X8.1
  Bottom 0.254: v41.25,50 41.25,61.75 v40.5,62.5
AS5  (via drill 0.51)
  Top 0.254: v45.12,49.12 46.25,48 46.25,47.25 U1.5
  Bottom 0.254: v45.12,49.12 41.75,49.12 41.62,49 40.88,49 37.25,52.62 37.25,61 32.5,65.75 16,65.75 14.88,66.88 14.88,68 18,71.12 25.38,71.12 27.88,73.62 X9.1
AS6  (via drill 0.51)
  Top 0.254: v27,54.25 28.88,52.38 28.88,46.75 32.88,42.75 40.38,42.75 42.5,44.88 42.5,47.12 U1.2 | v19.88,61.38 19.88,61.88 14.88,66.88 14.88,72 16.5,73.62 X10.1
  Bottom 0.254: v19.88,61.38 v27,54.25
AS7  (via drill 0.51)
  Top 0.254: v45,45.25 45,47.12 U1.4 | v37.62,50.88 37.62,54.38 36.75,55.25 16,55.25 10.75,60.5 10.75,66.62 5.12,72.25 5.12,73.62 X11.1
  Bottom 0.254: v45,45.25 43.25,45.25 v37.62,50.88
D8  (via drill 0.51)
  Top 0.254: v47.62,53.75 U1.11
  Bottom 0.254: v47.62,53.75 47.62,58.62 39.12,67.12 JP6.1
D9  (via drill 0.51)
  Top 0.254: v48.62,54.62 48.88,54.38 48.88,52 U1.10
  Bottom 0.254: v48.62,54.62 48.62,58.5 40.5,66.62 40.5,67.75 39.62,68.62 37.75,68.62 36.62,67.5 JP6.2
D10  (via drill 0.51)
  Top 0.254: v50.12,54.25 50.12,52 U1.9
  Bottom 0.254: v50.12,54.25 50.12,57.75 41.12,66.75 41.12,67.88 39.75,69.25 36.12,69.25 34.12,67.25 JP6.3
D11  (via drill 0.51)
  Top 0.254: v44.12,30.75 44.12,26.62 43.88,26.38 43.12,26.38 U2.6 | v40.62,44.38 40.62,45.88 38.62,47.88 v38.62,54.5
  Bottom 0.254: v44.12,30.75 44.12,40.88 v40.62,44.38 | v38.62,54.5 38.62,60.38 31.5,67.5 JP6.4
D51(MOSI)  (via drill 0.51)
  Top 0.254: v45.75,24.88 45,25.62 43.12,25.62 U2.5
  Bottom 0.254: v45.75,24.88 45.75,24 47,22.75 94.75,22.75 95.5,23.5 95.5,27.75 94.12,29.12 JP26.2
D52(SCLK)  (via drill 0.51)
  Top 0.254: v47.25,23.88 43.38,23.88 41.62,25.62 40.88,25.62 U2.4
  Bottom 0.254: v47.25,23.88 88.5,23.88 91.25,26.62 JP27.1
GND  (via drill 0.5)
  Top 0.254: 77.38,74.88 77.28,74.89 | 78.57,74.5 78.5,74.5 X5.2 78.75,73.88 | 77.5,74 77.27,74
  other vias: 96.52,38.1 78.74,15.24 58.42,16.51 53.34,52.07 59.69,35.56 66.04,43.18 68.58,36.83 49.53,62.23 44.45,58.42 71.12,54.61 40.64,30.48 38.1,63.5
  pour Bottom: 0,80.01 93.98,80.01 96.52,77.47 96.52,57.15 99.06,54.61 99.06,20.32 96.52,17.78 96.52,0 0,0 0,20.32 10.16,20.32 10.16,31.75 0,31.75 0,46.99 10.16,46.99 10.16,62.23 0,62.23
  pour Top: 0,80.01 93.98,80.01 96.52,77.47 96.52,57.15 99.06,54.61 99.06,20.32 96.52,17.78 96.52,0 0,0 0,20.32 10.16,20.32 10.16,31.75 0,31.75 0,46.99 10.16,46.99 10.16,62.23 0,62.23
N$1
  Top 0.254: U3.5 29.25,29.5 29.25,26.38 30.12,25.5 R1.1
N$2
  Top 0.254: U2.1 40.75,27.75 36.38,27.75 35.88,28.25 35.88,32.25 39.25,35.62 R13.2 39.38,35.75 43.75,40.12 43.75,47.12 U1.3
N$3
  Top 0.254: IC2.1 75.5,40 75.5,45.88 74.12,47.25 74.12,50.62 74.88,51.38 75.62,51.38 IC1.4
N$4
  Top 0.254: IC2.2 74.25,40 74.25,46.38 73.5,47.12 73.5,51.25 74.88,52.62 75.62,52.62 IC1.5
N$5
  Top 0.254: IC2.3 73,40 73,46.88 72.62,47.25 72.62,51.62 74.88,53.88 75.62,53.88 IC1.6
N$6
  Top 0.254: IC2.4 71.88,40 71.88,52.12 74.88,55.12 75.62,55.12 IC1.7
N$7
  Top 0.254: IC2.5 70.38,40 70.38,53.38 67.25,56.5 66.62,56.5 IC1.9
N$8
  Top 0.254: IC2.6 69.12,40 69.12,53.38 67.38,55.12 66.62,55.12 IC1.10
N$9
  Top 0.254: IC2.7 68,40 68,47.12 68.12,47.25 68.12,53.12 67.38,53.88 66.62,53.88 IC1.11
N$10  (via drill 0.51)
  Top 0.254: 78.62,41.75 78.62,44.75 75.75,47.62 IC1.1 | 78.62,41.75 78.62,40.38 R5.1 | v78.75,41.75 78.62,41.75
  Bottom 0.254: v78.75,41.75 78.75,28 JP5.2
N$11  (via drill 0.5)
  Top 0.254: 1.A 92.71,5.3 v92.71,8.89
  Bottom 0.254: v92.71,8.89 91.44,7.62 R8.1
N$12
  Top 0.254: U3.2 26.62,30.75 21.5,30.75 20,29.25 R2.1 20,29.12 16.62,25.75 16.62,25.12 R3.2
N$13
  Top 0.254: U3.3 26.62,30.12 25.88,30.12 22.88,27.12 22.88,26.38 R4.2 22.75,26.38 19.62,23.25 16.62,23.25 R3.1
N$14
  Top 0.254: 18.88,32.38 18.5,32.38 Q3.4 | 18.88,32.38 27.38,32.38 28.25,31.5 29.12,31.5 U3.8 | Q3.2 15.88,31.75 16.62,31 17.62,31 18.88,32.25 18.88,32.38
N$15
  Top 0.254: Q3.1 14.62,32.5 14.62,33.12 15.5,34 16.25,34 17.12,33.12 17.12,32.5 Q3.3
N$20
  Top 0.254: Y1.P$2 47,38 51.62,38 52,37.62 IC4.1
N$21
  Top 0.254: Y1.P$1 47,35.62 52.12,35.62 53.25,36.75 53.25,37.5 IC4.2
N$22
  Top 0.254: IC4.3 54.62,37.5 54.62,36.88 62.25,29.25 66.5,29.25 67.38,28.38 67.38,18.38 63,14 41.25,14 36.12,8.88 21.38,8.88 20.12,10.12 G1.+
N$23  (via drill 0.5)
  Top 0.254: 2.A 87.63,5.3 v87.63,8.89
  Bottom 0.254: v87.63,8.89 86.36,7.62 R9.1
N$24  (via drill 0.51)
  Top 0.254: IC1.2 75.75,48.88 76.5,48.88 80.25,45.12 80.25,44.5 R6.1 80.25,44.38 81.25,43.38 v81.25,42.88
  Bottom 0.254: v81.25,42.88 81.25,28 JP5.4
N$25
  Top 0.254: IC1.3 75.75,50.12 76.5,50.12 78.25,48.38 81.5,48.38 R7.1 81.62,48.38 82.75,49.5 84.25,49.5 84.62,49.12 84.62,47.38 83.88,46.62 83.88,28 JP5.6
N$26
  Top 0.254: 48.25,25.38 JP9.1 48.25,25.25 48.25,19.38 JP8.1 48.25,19.25
N$27
  Top 0.254: JP9.3 50.75,25.38 50.75,19 JP8.2
N$28
  Top 0.254: JP9.5 53.38,25.38 53.38,19.25 JP8.3
N$29
  Top 0.254: JP9.7 55.88,25.38 55.88,19 JP8.4
N$30
  Top 0.254: JP9.9 58.38,25.38 58.38,19.25 JP8.5
N$31
  Top 0.254: JP9.11 61,25.38 61,19 JP8.6
N$32  (via drill 0.5)
  Top 0.254: 3.A 82.55,5.3 v82.55,8.89
  Bottom 0.254: v82.55,8.89 81.28,7.62 R10.1
N$36
  Top 0.254: JP9.16 66,28 63.62,28 JP9.14 63.5,28 61,28 JP9.12 60.88,28 58.5,28 JP9.10 58.38,28 56,28 JP9.8 55.88,28 53.38,28 JP9.6 53.25,28 50.88,28 JP9.4 50.75,28 48.38,28 JP9.2 48.25,28 43.5,32.75 39.38,32.75 R13.1 39.25,32.75 37,30.5 37,29.25 C8.A
N$37
  Top 0.254: JP8.7 JP9.13
N$38
  Top 0.254: JP9.15 66,25.38 66,19 JP8.8
N$40  (via drill 0.51)
  Top 0.254: v32.38,40.75 30.38,42.75 MISHA1.TXD
  Bottom 0.254: R23.1 30.75,36.88 33.25,39.38 33.25,39.62 Q1.2 33.38,39.75 v32.38,40.75
N$41  (via drill 0.51)
  Top 0.254: v27.88,48.5 28.25,48.12 28.25,42.88 MISHA1.RXD
  Bottom 0.254: 27,48.5 R24.1 | 27,48.5 27,49.75 Q2.2 | 27,48.5 v27.88,48.5
N$42
  Top 0.254: R1.2 28.25,25.5 28.25,29 27.75,29.5 27.75,31.25 27.5,31.5 26.75,31.5 U3.1 26.62,31.5 20.25,31.5 18,29.25 R2.2 17.88,29.25 15.88,29.25 13.88,31.25 13.88,33.75 14.12,34 14.12,35 14.43,35.56
  Top 1.27: J1.3 14.43,35.56 16.51,35.56 17.14,36.2 Q3.6
N$46  (via drill 0.5)
  Top 0.254: 4.A 77.47,5.3 v77.47,8.89
  Bottom 0.254: v77.47,8.89 76.2,7.62 R11.1
N$47  (via drill 0.5)
  Top 0.254: 5.A 72.39,5.3 v72.39,8.89
  Bottom 0.254: v72.39,8.89 71.12,7.62 R12.1
N$48  (via drill 0.5)
  Top 0.254: 6.A 67.31,5.3 v67.31,8.89
  Bottom 0.254: v67.31,8.89 66.04,7.62 R14.1
N$49  (via drill 0.5)
  Top 0.254: 7.A 62.23,5.3 v62.23,8.89
  Bottom 0.254: v62.23,8.89 60.96,7.62 R15.1
N$50  (via drill 0.5)
  Top 0.254: 8.A 57.15,5.3 v57.15,8.89
  Bottom 0.254: v57.15,8.89 55.88,7.62 R16.1
N$126  (via drill 0.51)
  Top 0.254: v28.12,6.12 22.88,6.12 LED9.A
  Bottom 0.254: v28.12,6.12 28.38,6.12 29.5,5 R22.1
RX1
  Top 0.254: JP2.2 5,66 3.75,64.75 3.75,64.62 3.12,64 2,64 1.25,64.75 1.25,73.62 4.5,76.88 85,76.88 86.62,75.25 86.62,72 83.5,68.88 80.38,68.88 78.75,67.25 JP16.3
RX2
  Bottom 0.254: R25.1 33.25,58.38 32.62,57.75 32.62,43 33.88,41.75 34.25,41.75 Q1.3 34.38,41.75 35.88,41.75 39.5,45.38 41,45.38 42.12,44.25 49.88,44.25 72.75,67.12 73.62,67.12 JP16.5
SCL  (via drill 0.51)
  Top 0.254: 61.38,53.25 61.88,53.25 64.88,50.25 66.5,50.25 IC1.14 | 61.38,53.25 60.75,53.25 R9*.1 61.12,53.12 v59.75,51.75 | v54.62,46.62 54.62,43.75 IC4.6 | v73.88,57.25 65.25,57.25 61.38,53.38 61.38,53.25
  Bottom 0.254: v59.75,51.75 v54.62,46.62 | v73.88,57.25 83.75,67.12 JP16.1
SDA  (via drill 0.51)
  Top 0.254: 62.12,49.5 65.12,49.5 65.62,49 66.5,49 IC1.15 | 62.12,49.5 60.75,49.5 R8*.1 | v57,43.75 56,43.75 IC4.5 | 62.12,49.5 v62.12,48.88
  Bottom 0.254: v57,43.75 v62.12,48.88 62.12,50.75 64.25,52.88 66.38,52.88 80.88,67.38 81.25,67.38 JP16.2
TX1  (via drill 0.51)
  Top 0.254: v76.12,74.38 74.25,76.25 4.62,76.25 2.62,74.25 2.62,66.12 JP2.1
  Bottom 0.254: v76.12,74.38 76.12,67.5 JP16.4
TX2  (via drill 0.51)
  Top 0.254: v44.38,64.88 39.25,59.75 v32,59.75
  Bottom 0.254: 32.06,59.69 33.25,60.88 R26.1 | 32.06,59.69 28,55.62 28,52 Q2.3 | v44.38,64.88 68.25,64.88 70.75,67.38 71,67.38 JP16.6 | v32,59.75 32.06,59.69
VDD  (via drill 0.51, 1.3)
  Top 0.254: 58.75,52 58.75,53.25 R9*.2 | 58.75,52 58.75,49.62 R8*.2 58.75,49.5 58.75,48.5 60.5,46.75 62.12,46.75 C9.1 62.25,46.75 64.75,46.75 | C14.1 49.88,56 51,57.12 54.88,57.12 58.62,53.38 R9*.2 | IC4.8 52.12,43.75 52.12,45.5 58.62,52 58.75,52 | R7.2 83.5,47 82.25,45.75 82.25,44.5 R6.2 82.25,44.38 82.25,41.88 79.62,39.25 79.5,39.25 78.75,38.5 R5.2 78.62,38.5 64.75,38.5 | 64.75,34.5 66,34.5 66.62,33.88 IC2.9 | 64.75,34.5 63.5,34.5 C10.1 | 64.75,46.75 65.62,46.75 66.5,47.62 IC1.16 | 64.75,46.75 64.75,38.5 | 64.75,38.5 64.75,34.5 | v36.25,56.88 37.62,56.88 41.25,53.25 41.25,52 U1.16 | 33.81,26.94 34.5,26.25 34.5,25.5 C1.1 34.5,25.38 29.12,20 29.12,18.5 30.5,17.12 30.5,11.5 X2.2 | 33.81,26.94 30,30.75 29.25,30.75 U3.7 | 33.81,26.94 33.88,27 40.75,27 U2.2 40.88,27 41.62,27 41.88,27.25 41.88,27.38 42.12,27.62 43,27.62 U2.8 | R9*.2 58.62,53.5 70.38,65.25 89.25,65.25 91.25,67.25 JP25.1
  Top 1.27: Q3.8 14.61,40.01 v13.97,40.64
  Bottom 0.254: R8.2 91.38,2.88 86.38,2.88 R9.2 86.25,2.88 81.38,2.88 R10.2 81.25,2.88 76.25,2.88 R11.2 76.12,2.88 71.12,2.88 R12.2 71,2.88 66.12,2.88 R14.2 66,2.88 61,2.88 R15.2 60.88,2.88 56,2.88 R16.2 55.88,2.88 31.75,2.88 | v36.25,56.88 36.25,57.38 35.25,58.38 R25.2 35.25,58.5 35.25,60.88 R26.2 35.12,61 34.38,61.75 34.38,61.88 34,62.25 20.38,62.25 19.12,63.5 C11.A 12.25,63.5 11.84,63.09
  Bottom 1.27: JP25.2 JP25.1 93.98,67.31 95.25,68.58 95.25,76.2 92.71,78.74 8.89,78.74 7.62,77.47 7.62,67.31 11.84,63.09 12.7,62.23 12.7,54.61 | X2.1 X2.2 31.43,10.52 R22.2 31.75,4.63 31.75,2.88 31.75,1.27 15.24,1.27 13.97,2.54 v13.97,40.64 13.97,41.91 12.7,43.18 12.7,54.61 | 12.7,54.61 15.67,54.61 IC3.3

### Text on the board
tPlace: 5V | TX1 | RX1 | 9 | 8 | 7 | 6 | 5 | 4 | 3 | 2 | 1 | 0 | 22 | 13 | 12 | 11 | 10 | 14 | 15 | 16 | 17 | 18 | 19 | 20 | 21 | GND | 24 | AREF | PWM | TX | RX | TX3 | RX3 | TX2 | RX2 | TX1 | RX1 | SDA | SCL | 26 | 28 | 30 | 31 | 32 | 33 | 34 | 35 | 36 | 37 | 38 | 39 | 40 | 41 | DIGITAL | 42 | 43 | 44 | 45 | 46 | 47 | 48 | 49 | 50 | 51 | 52 | 53 | GND | RES | 3V3 | 5V | GND | VIN | 0 | 1 | 2 | 3 | 4 | 5 | 6 | 7 | 8 | 9 | 10 | 11 | 12 | 13 | 14 | 15 | POWER | 2-pin VDD | 2-pin GND
bPlace: Thermoshield v2.1 / OddCloset (C) 2016
tNames: T-8 | T-7 | T-6 | T-5 | T-4 | T-3 | T-2 | T-1